# EAGLE schematic UV_MONITOR_V2 (EAGLE 8.4.0)
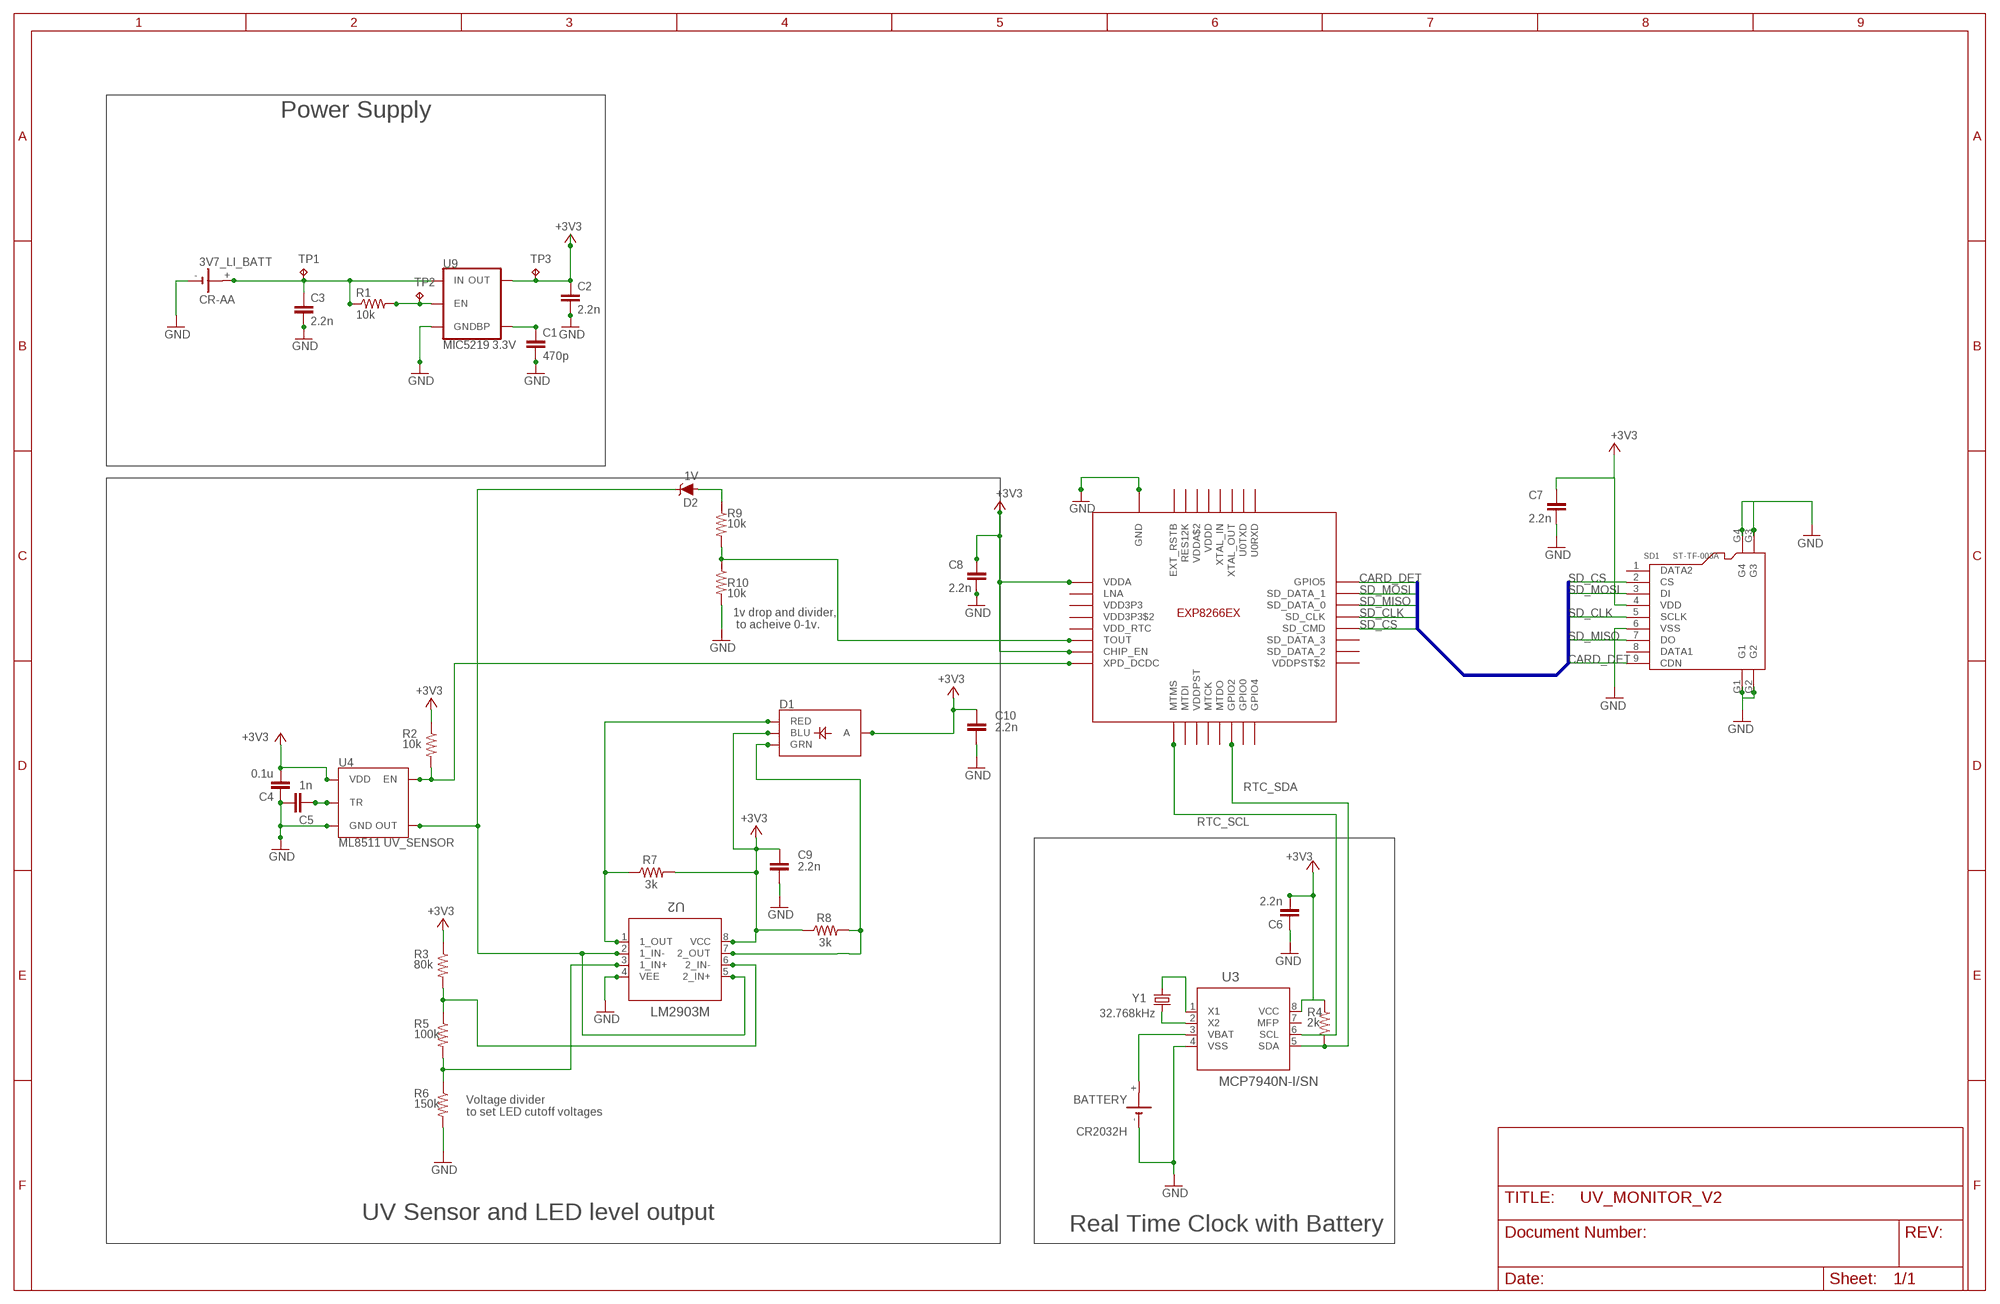
[diagram p0: schematic, sheet 1]

## Parts
3V7_LI_BATT  CR-AA  [CRAA]
BATTERY  CR2032H  [CR2032H]
C1  470p  C-EUC0805  [C0805]
C2  2.2n  C-EUC0805  [C0805]
C3  2.2n  C-EUC0805  [C0805]
C4  0.1u  C-EUC0805  [C0805]
C5  1n  C-EUC0805  [C0805]
C6  2.2n  C-EUC0805  [C0805]
C7  2.2n  C-EUC0805  [C0805]
C8  2.2n  C-EUC0805  [C0805]
C9  2.2n  C-EUC0805  [C0805]
C10  2.2n  C-EUC0805  [C0805]
D1  LED-RGB-CASMD  [LED-TRICOLOR-SMD]
D2  1V  DIODE-ZENER-BZT52C3V6S  [SOD-323]
R1  10k  R-US_R0805  [R0805]
R2  10k  R-US_R0805  [R0805]
R3  80k  R-US_R0805  [R0805]
R4  2k  R-US_R0805  [R0805]
R5  100k  R-US_R0805  [R0805]
R6  150k  R-US_R0805  [R0805]
R7  3k  R-US_R0805  [R0805]
R8  3k  R-US_R0805  [R0805]
R9  10k  R-US_R0805  [R0805]
R10  10k  R-US_R0805  [R0805]
SD1  ST-TF-003A  MICRO-SD-CARD-SOCKET-9P(ST-TF-003A)  [MICRO-SD9+4P-SMD-16.1X14.5X1.85MM]
TP1  TPPAD1-13  [P1-13]
TP2  TPPAD1-13  [P1-13]
TP3  TPPAD1-13  [P1-13]
U1  ESP8266EX  [ESP8266EX]
U2  LM2903M  [M08A]
U3  MCP7940N-I/SN  [SOIC8-N_MC]
U4  ML8511 UV_SENSOR  ML8511  [ML8511]
U9  MIC5219 3.3V  V_REG_MIC52193.3V  [SOT23-5]
Y1  32.768kHz  CRYSTAL-32.768KHZSMD-2X6  [CRYSTAL-SMD-2X6-CYL]

## Nets
+3V3: C2.1 C4.2 C6.2 C7.1 C8.1 C9.1 C10.1 D1.A D1.B(BLU) R2.1 R3.1 R4.1 R7.2 R8.1 SD1.4(VDD) TP3.TP U1.CHIP_EN U1.VDDA U2.8(VCC) U3.8(VCC) U4.7(VDD) U9.5(OUT)
CARD_DET: SD1.9(CDN) U1.GPOIO5(GPIO5)
GND: 3V7_LI_BATT.- BATTERY.- C1.2 C2.2 C3.2 C4.1 C5.2 C6.1 C7.2 C8.2 C9.2 C10.2 R6.2 R10.2 SD1.6(VSS) SD1.G1 SD1.G2 SD1.G3 SD1.G4 U1.GND U2.4(VEE) U3.4(VSS) U4.5(GND) U9.2(GND)
N$1: 3V7_LI_BATT.+ C3.1 R1.1 TP1.TP U9.1(IN)
N$2: U3.2(X2) Y1.X2
N$3: R1.2 TP2.TP U9.3(EN)
N$4: C5.1 U4.10(TR)
N$5: C1.1 U9.4(BP)
N$6: U3.1(X1) Y1.X1
N$7: R3.2 R5.1 U2.6(2_IN-)
N$8: R5.2 R6.1 U2.3(1_IN+)
N$9: BATTERY.+ U3.3(VBAT)
N$10: D2.A R9.1
N$11: D2.C U2.2(1_IN-) U2.5(2_IN+) U4.8(OUT)
N$12: D1.R(RED) R7.1 U2.1(1_OUT)
N$13: R9.2 R10.1 U1.TOUT
N$14: R2.2 U1.XPD_DCDC U4.4(EN)
N$18: D1.G(GRN) R8.2 U2.7(2_OUT)
RTC_SCL: U1.MTMS U3.6(SCL)
RTC_SDA: R4.2 U1.GPIO2 U3.5(SDA)
SD_CLK: SD1.5(SCLK) U1.SD_CLK
SD_CS: SD1.2(CS) U1.SD_CMD
SD_MISO: SD1.7(DO) U1.SD_DATA_0
SD_MOSI: SD1.3(DI) U1.SD_DATA_1
Unconnected: 3V7_LI_BATT.+@1(+) BATTERY.+@1(+) SD1.1(DATA2) SD1.8(DATA1) U1.EXT_RSTB U1.GPIO0 U1.GPIO4 U1.LNA U1.MTCK U1.MTDI U1.MTDO U1.RES12K U1.SD_DATA_2 U1.SD_DATA_3 U1.U0RXD U1.U0TXD U1.VDD3P3 U1.VDD3P3$2 U1.VDD_RTC U1.VDDA$2 U1.VDDD U1.VDDPST U1.VDDPST$2 U1.XTAL_IN U1.XTAL_OUT U3.7(MFP)

## Buses
SD_CARD

## Notes on the sheet
- Power Supply
- 1v drop and divider,
   to acheive 0-1v.
- Voltage divider
  to set LED cutoff voltages
- UV Sensor and LED level output
- Real Time Clock with Battery

## Library data of the parts
3V7_LI_BATT = battery:CR-AA: LI BATTERY Varta CRAA-SLF
BATTERY = battery:CR2032H: LI BATTERY Varta
C1-C10 = rcl:C-EU: CAPACITOR, European symbol
D1 = SparkFun-LED:LED-RGB-CA: LED-RGB Diffused Common Anode Packages: LED RGB-THRU P-LCC-4-3 LED-TRICOLOR-SMD SparkFun Products: RGB Diffused Common Anode- Diffuse <[https://www.sparkfun.com/products/10821]> RGB Diffused Common Anode - Clear <[https://www.sparkfun.com/products/10820]> Qduino Mini <[https://www.sparkfun.com/products/13614]> Triple Output LED RGB - SMD <https://www.sparkfun.com/products/7844>; PROD_ID: DIO-08324
D2 = SparkFun-DiscreteSemi:DIODE-ZENER: Zener Diode A Zener diode allows current to flow from its anode to its cathode like a normal semiconductor diode, but it also permits current to flow in the reverse direction when its "Zener voltage" is reached. - WIkipedia; PROD_ID: DIO-08199; VALUE: 3.6V
R1-R10 = rcl:R-US_: RESISTOR, American symbol
SD1 = Seeed-Connector:MICRO-SD-CARD-SOCKET-9P(ST-TF-003A): 320090000; MPN: ST-TF-003A
TP1-TP3 = testpad:TP: Test pad
U1 = ESP8266EX:ESP8266EX
U2 = LM2903M:LM2903M; MANUFACTURER_PART_NUMBER: LM2903M; VENDOR: Texas Instruments
U3 = MCP7940N:MCP7940N-I/SN; MANUFACTURER_PART_NUMBER: MCP7940NISN; VENDOR: MICROCHIP
U4 = SparkFun-Sensors:ML8511: Lapis ML8511 Ultraviolet Sensor The MP8511 UV (ultraviolet) Sensor works by outputing an analog signal in relation to the amount of UV light that’s detected. This sensor detects 280-390nm light most effectively. This is categorized as part of the UVB (burning rays) spectrum and most of the UVA (tanning rays) spectrum. It outputs a analog voltage that is linearly related to the measured UV intensity (mW/cm2). Datasheet <https://cdn.sparkfun.com/datasheets/Sensors/LightImaging/ML8511_3-8-13.pdf> SparkFun Products SparkFun UV Sensor Breakout - ML8511 <https://www.sparkfun.com/products/12705> (SEN-12705); PROD_ID: IC-11927
U9 = SparkFun-IC-Power:V_REG_MIC5219: V_REG MIC5219 Standard 3.3V and 5V 500mA LDO voltage regulator in SOT-23 layout. Micrel part MIC5219. BP (by-pass) pin is used to lower output noise with 470pF cap, may be left open.; PROD_ID: VREG-09872
Y1 = SparkFun-Clocks:CRYSTAL-32.768KHZ: 32.768kHz Crystal Frequency: 32.768kHz Frequency Stability: ±20ppm Load Capacitance: 12.5pF (PTH-2X6 & SMD-3.2X1.5), 6pF (SMD-2X6) SparkFun Products: SparkFun BigTime Watch Kit <https://www.sparkfun.com/products/11734> SparkFun nRF52832 Breakout <https://www.sparkfun.com/products/13990> SparkFun Real Time Clock Module <https://www.sparkfun.com/products/12708>; PROD_ID: XTAL-07894